# Altium schematic sheet BNO055.SchDoc
size A
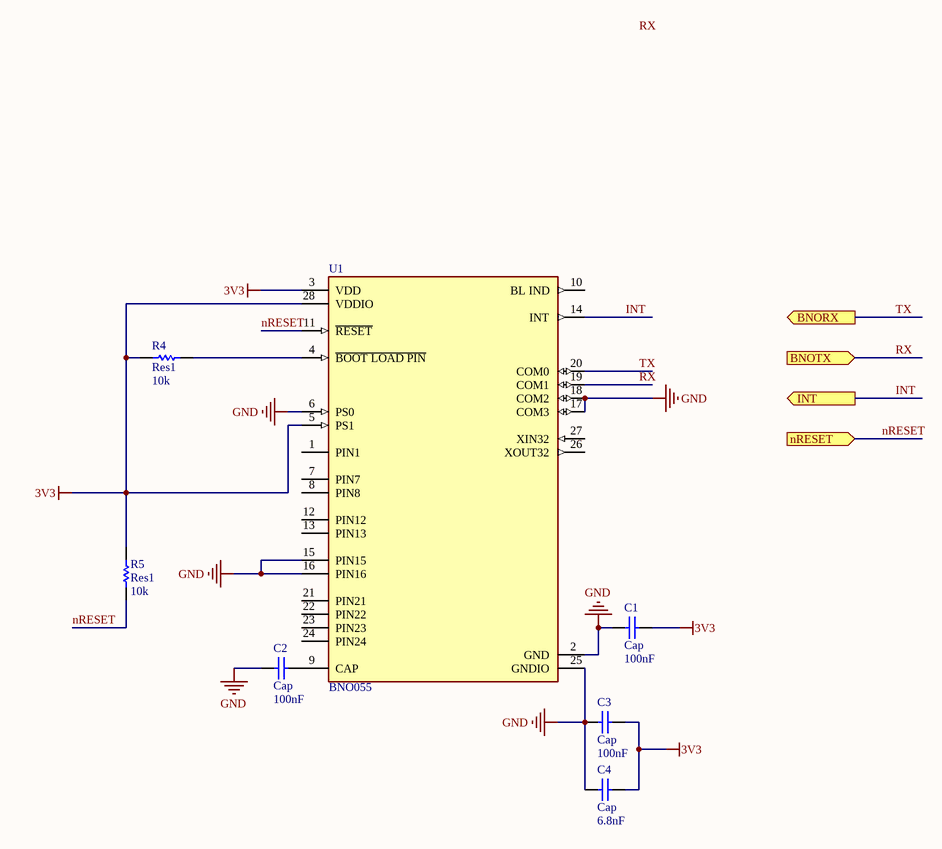
[diagram p0: BNO055.SchDoc]

## Parts
C1  Cap  value 100nF  [0402-A]
C2  Cap  value 100nF  [0402-A]
C3  Cap  value 100nF  [0402-A]
C4  Cap  value 6.8nF  [0402-A]
R4  Res1  value 10k  [0402-A]
R5  Res1  value 10k  [0402-A]
U1  BNO055  [FP-BNO055-MFG]

## Ports
BNORX (out), BNOTX (in), INT (out), nRESET (in)

## Nets
3V3: C1.2 C3.2 C4.2 R4.1 R5.2 U1.3(VDD) U1.5(PS1) U1.28(VDDIO)
GND: C1.1 C2.1 C3.1 C4.1 U1.2(GND) U1.6(PS0) U1.15(PIN15) U1.16(PIN16) U1.17(COM3) U1.18(COM2) U1.25(GNDIO)
INT: U1.14(INT) ; port INT
nRESET: R5.1 U1.11(~{RESET}) ; port nRESET
RX: U1.19(COM1) ; port BNOTX
TX: U1.20(COM0) ; port BNORX
NetC2_2: C2.2 U1.9(CAP)
NetR4_2: R4.2 U1.4(~{BOOT_LOAD_PIN})

Not connected (* = marked no-connect by the designer): U1 1(PIN1) 7(PIN7) 8(PIN8) 10(BL_IND) 12(PIN12) 13(PIN13) 21(PIN21) 22(PIN22) 23(PIN23) 24(PIN24) 26(XOUT32) 27(XIN32)

## Notes on the sheet
- Labels drawn without touching a wire or pin: RX

## Library data of the parts
C1-C4 = Cap: Capacitor; Published: 8-Jun-2000; LatestRevisionDate: 17-Jul-2002; LatestRevisionNote: Re-released for DXP Platform.; PackageReference: RAD-0.3; Publisher: Altium Limited; PackageDescription: Radial Cap, Thru-Hole; 2 Leads; 0.3 in Pin Spacing
R4 R5 = Res1: Resistor; Published: 8-Jun-2000; LatestRevisionDate: 17-Jul-2002; LatestRevisionNote: Re-released for DXP Platform.; PackageReference: AXIAL-0.3; Publisher: Altium Limited; PackageDescription: Axial Device, Thru-Hole; 2 Leads; 0.3 in Pin Spacing
U1 = CMP-191067-000002-1: IMU ACCEL/GYRO/MAG I2C 28LGA; Manufacturer: Bosch Sensortech; Max Supply Voltage: 3.6V; Voltage: 1.7~3.6V; Operating Supply Current: 12.3mA; Gyro Sensitivity: 16LSB/°/s; Sensor Type: Accelerometer,Gyroscope,Magnetometer; Accel Sensitivity: 0.001LSB/g; Min Supply Voltage: 1.7V; Accel Range: 2/4/8/16g; Accel Resolution: 14bits; Sensor Output: I2C,UART; Gyro Range: 125/250/500/1000/2000°/s; Mag Sense Range: 1300-2500uT; Octopart: https://octopart.com/bno055-bosch+sensortec-50309911; Height: 1.18mm; Automotive: No; Mouser Description: BNO055 Series 1.7 to 3.6 V Intelligent 9-Axis Absolute Orientation Sensor-LGA-28; Lead Free: Yes; Temperature Range High: +85°C; Ambient Temperature Range Low: -40°C; Ambient Temperature Range High: +85°C; Device Class L1: Sensors; Device Class L3: Inertial Measurement Units (IMUs); ComponentLink2URL: https://ae-bst.resource.bosch.com/media/_tech/media/datasheets/BST-BNO055-DS000.pdf; Temperature Range Low: -40°C; Manufacturer Part Number: BNO055; Digikey Description: IMU ACCEL/GYRO/MAG I2C 28LGA; Device Class L2: Motion Sensors; RoHS: TRUE; Category: IC; Temperature: -40°C to +85°C; ComponentLink2Description: Datasheet; Package: 0